# Altium schematic sheet Gate_Driver.SchDoc
size A4; SheetNumber: 2; SheetTotal: 3
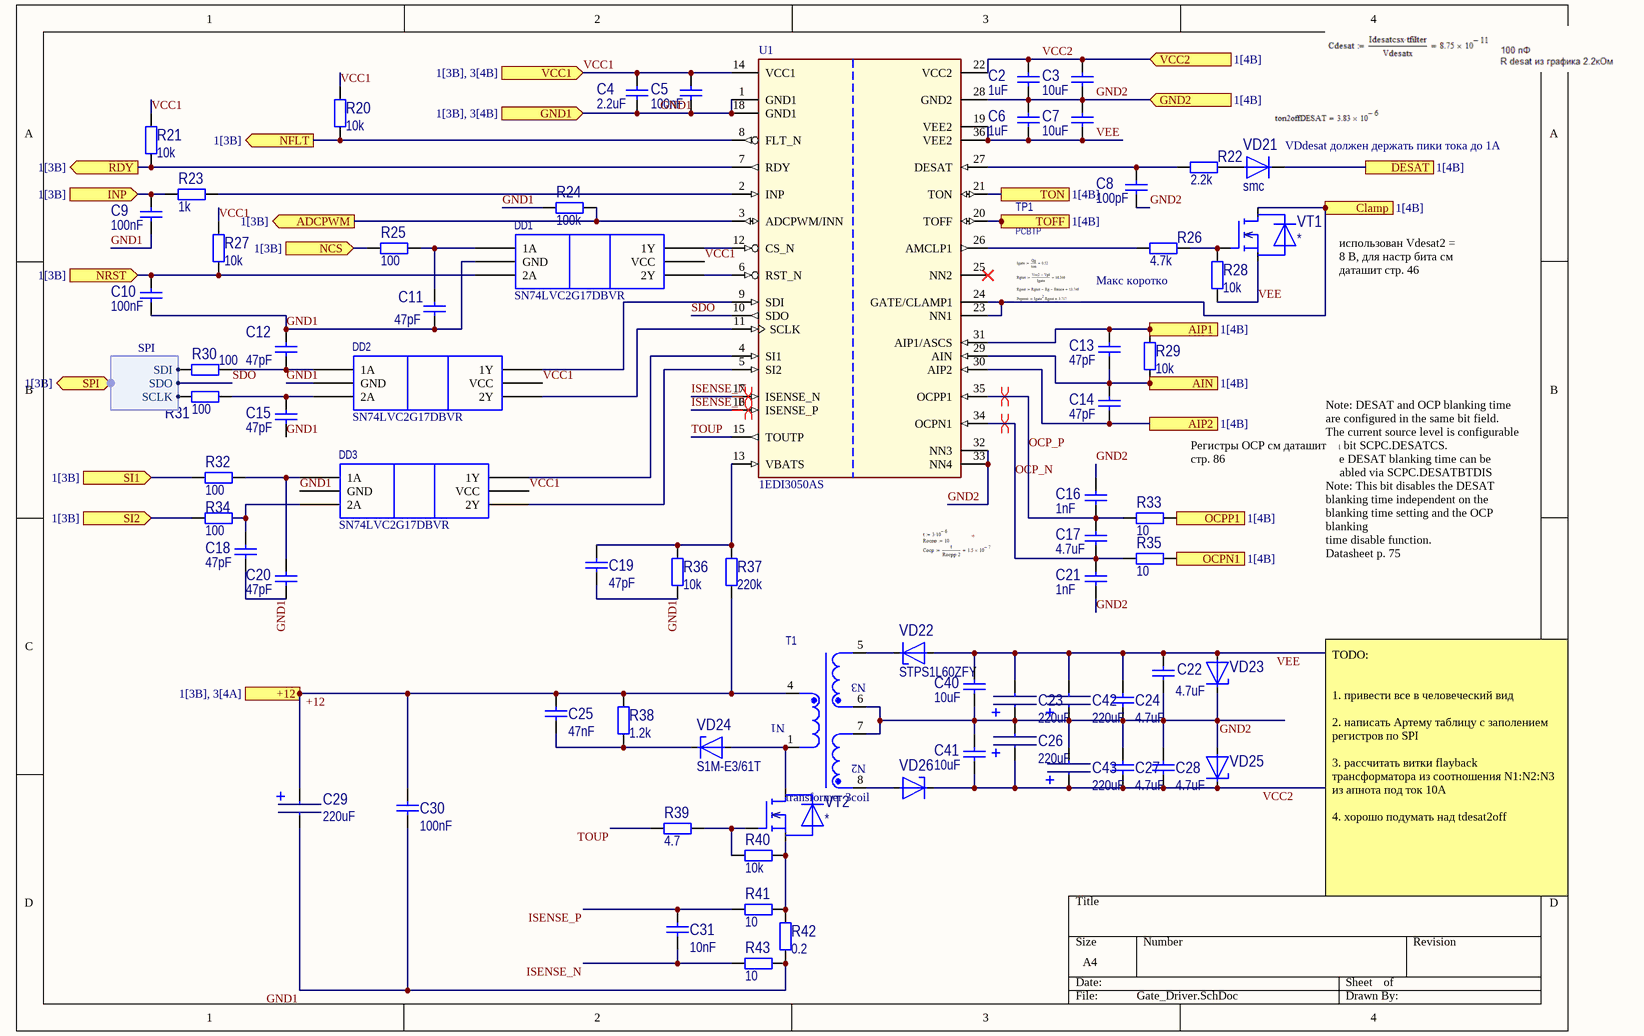
[diagram p0: Gate_Driver.SchDoc]

## Parts
C2  1uF  [6332[2512]]
C3  10uF  [6332[2512]]
C4  2.2uF  [3216[1206]]
C5  100nF  [2012[0805]]
C6  1uF  [6332[2512]]
C7  10uF  [6332[2512]]
C8  100pF  [2012[0805]]
C9  100nF  [2012[0805]]
C10  100nF  [2012[0805]]
C11  47pF  [2012[0805]]
C12  47pF  [2012[0805]]
C13  47pF  [2012[0805]]
C14  47pF  [2012[0805]]
C15  47pF  [2012[0805]]
C16  1nF  [2012[0805]]
C17  4.7uF  [2012[0805]]
C18  47pF  [2012[0805]]
C19  47pF  [2012[0805]]
C20  47pF  [2012[0805]]
C21  1nF  [2012[0805]]
C22  4.7uF  [6332[2512]]
C23  220uF  [ECAP 220 50V]
C24  4.7uF  [6332[2512]]
C25  47nF  [2012[0805]]
C26  220uF  [ECAP 220 50V]
C27  4.7uF  [6332[2512]]
C28  4.7uF  [6332[2512]]
C29  220uF  [A(3216)]
C30  100nF  [6332[2512]]
C31  10nF  [1005[0402]]
C40  10uF  [6332[2512]]
C41  10uF  [6332[2512]]
C42  220uF  [ECAP 220 50V]
C43  220uF  [ECAP 220 50V]
DD1  SN74LVC2G17DBVR  [SOT23-6]
DD2  SN74LVC2G17DBVR  [SOT23-6]
DD3  SN74LVC2G17DBVR  [SOT23-6]
R20  10k  [2012[0805]]
R21  10k  [2012[0805]]
R22  2.2k  [3216[1206]]
R23  1k  [2012[0805]]
R24  100k  [1005[0402]]
R25  100  [2012[0805]]
R26  4.7k  [2012[0805]]
R27  10k  [2012[0805]]
R28  10k  [2012[0805]]
R29  10k  [2012[0805]]
R30  100  [2012[0805]]
R31  100  [2012[0805]]
R32  100  [2012[0805]]
R33  10  [2012[0805]]
R34  100  [2012[0805]]
R35  10  [2012[0805]]
R36  10k  [2012[0805]]
R37  220k  [2012[0805]]
R38  1.2k  [2012[0805]]
R39  4.7  [2012[0805]]
R40  10k  [2012[0805]]
R41  10  [2012[0805]]
R42  0.2  [2512]
R43  10  [2012[0805]]
T1  transformer 3coil  [E 13/7/4]
TP1  PCBTP
U1  1EDI3050AS
VD21  smc  [SMС]
VD22  STPS1L60ZFY  [SOD-123]
VD23  (no value)  [SMС]
VD24  S1M-E3/61T  [SMB]
VD25  (no value)  [SMС]
VD26  (no value)  [SOD-123]
VT1  *
VT2  *

## Ports
+12 (in, see 1[3B], 3[4A]), ADCPWM (out, see 1[3B]), AIN (see 1[4B]), AIP1 (see 1[4B]), AIP2 (see 1[4B]), Clamp (see 1[4B]), DESAT (see 1[4B]), GND1 (in, see 1[3B], 3[4B]), GND2 (in, see 1[4B]), INP (in, see 1[3B]), NCS (in, see 1[3B]), NFLT (out, see 1[3B]), NRST (in, see 1[3B]), OCPN1 (see 1[4B]), OCPP1 (see 1[4B]), RDY (out, see 1[3B]), SI1 (in, see 1[3B]), SI2 (in, see 1[3B]), SPI (bidir, harness SPI, see 1[3B]), TOFF (see 1[4B]), TON (see 1[4B]), VCC1 (in, see 1[3B], 3[4B]), VCC2 (in, see 1[4B])

## Harnesses
SPI: SDI, SDO, SCLK

## Nets
+12: C25.1 C29.1 C30.1 R37.1 R38.2 T1.4 ; port +12
ADCPWM: R24.1 U1.3(ADCPWM/INN) ; port ADCPWM
AIN: C13.2 C14.1 R29.1 U1.29(AIN) ; port AIN
AIP1: C13.1 R29.2 U1.31(AIP1/ASCS) ; port AIP1
AIP2: C14.2 U1.30(AIP2) ; port AIP2
Clamp: U1.23(NN1) U1.24(GATE/CLAMP1) VT1.1(D) ; port Clamp
DESAT: VD21.2(K) ; port DESAT
GND1: C4.2 C5.2 C9.2 C10.2 C11.2 C12.1 C15.2 C18.2 C19.2 C20.2 C29.2 C30.2 DD1.2(GND) DD2.2(GND) DD3.2(GND) R24.2 R36.1 R42.2 R43.1 U1.1(GND1) U1.18(GND1) ; port GND1
GND2: C2.2 C3.2 C6.1 C7.1 C8.2 C16.1 C21.2 C22.1 C23.1 C24.1 C26.2 C27.2 C28.2 C40.2 C41.1 C42.1 C43.2 T1.6 T1.7 U1.28(GND2) U1.32(NN3) U1.33(NN4) VD23.2(K) VD25.1(A) ; port GND2
INP: C9.1 R23.2 ; port INP
ISENSE_N: C31.2 R43.2 U1.17(ISENSE_N)
ISENSE_P: C31.1 R41.2 U1.16(ISENSE_P)
NCS: R25.2 ; port NCS
NFLT: R20.1 U1.8(FLT_N) ; port NFLT
NRST: C10.1 DD1.3(2A) R27.1 ; port NRST
OCP_N: C17.2 C21.1 R35.2 U1.34(OCPN1)
OCP_P: C16.2 C17.1 R33.2 U1.35(OCPP1)
OCPN1: R35.1 ; port OCPN1
OCPP1: R33.1 ; port OCPP1
RDY: R21.1 U1.7(RDY) ; port RDY
SDO: U1.10(SDO) ; port SPI.SDO
SI1: R32.2 ; port SI1
SI2: R34.2 ; port SI2
TOFF: TP1.1 U1.20(TOFF) ; port TOFF
TON: U1.21(TON) ; port TON
TOUP: R39.1 U1.15(TOUTP)
VCC1: C4.1 C5.1 DD1.5(VCC) DD2.5(VCC) DD3.5(VCC) R20.2 R21.2 R27.2 U1.14(VCC1) ; port VCC1
VCC2: C2.1 C3.1 C26.1 C27.1 C28.1 C41.2 C43.1 U1.22(VCC2) VD25.2(K) VD26.2(K) ; port VCC2
VEE: C6.2 C7.2 C22.2 C23.2 C24.2 C40.1 C42.2 R28.1 U1.19(VEE2) U1.36(VEE2) VD22.1(A) VD23.1(A) VT1.3(S)
NetC8_1: C8.1 R22.1 U1.27(DESAT)
NetC11_1: C11.1 DD1.1(1A) R25.1
NetC12_2: C12.2 DD2.1(1A) R30.1
NetC15_1: C15.1 DD2.3(2A) R31.1
NetC18_1: C18.1 DD3.3(2A) R34.1
NetC19_1: C19.1 R36.2 R37.2 U1.13(VBATS)
NetC20_1: C20.1 DD3.1(1A) R32.1
NetC25_2: C25.2 R38.1 VD24.2(K)
NetDD1_4: DD1.4(2Y) U1.6(RST_N)
NetDD1_6: DD1.6(1Y) U1.12(CS_N)
NetDD2_4: DD2.4(2Y) U1.11(SCLK)
NetDD2_6: DD2.6(1Y) U1.9(SDI)
NetDD3_4: DD3.4(2Y) U1.5(SI2)
NetDD3_6: DD3.6(1Y) U1.4(SI1)
NetR22_2: R22.2 VD21.1(A)
NetR23_1: R23.1 U1.2(INP)
NetR26_1: R26.1 U1.26(AMCLP1)
NetR26_2: R26.2 R28.2 VT1.2(G)
NetR30_2: R30.2 ; port SPI.SDI
NetR31_2: R31.2 ; port SPI.SCLK
NetR39_2: R39.2 R40.2 VT2.2(G)
NetR40_1: R40.1 R41.1 R42.1 VT2.3(S)
NetT1_1: T1.1 VD24.1(A) VT2.1(D)
NetT1_5: T1.5 VD22.2(K)
NetT1_8: T1.8 VD26.1(A)

Not connected (* = marked no-connect by the designer): U1 25(NN2)*

## Layout directives
differential pair: ISENSE_N, ISENSE_P, OCP_N, OCP_P

## Notes on the sheet
- (near VD21) VDdesat должен держать пики тока до 1А
- (near R26) Макс коротко
- использован Vdesat2 = 8 В, для настр бита см даташит стр. 46
- (near R33) Регистры OCP см даташит стр. 86
- Note: DESAT and OCP blanking time are configured in the same bit field.
  The current source level is configurable via bit SCPC.DESATCS.
  The DESAT blanking time can be disabled via SCPC.DESATBTDIS
  Note: This bit disables the DESAT blanking time independent on the blanking time setting and the OCP blanking
  time disable function.
  Datasheet p. 75
- TODO:
  1. привести все в человеческий вид
  2. написать Артему таблицу с заполением регистров по SPI
  3. рассчитать витки flayback трансформатора из соотношения N1:N2:N3 из апнота под ток 10А
  4. хорошо подумать над tdesat2off
- (in symbol transformer 3coil) N3; N1; N2

## Library data of the parts
C2-C22 C24 C25 C27 C28 C30 C31 C40 C41 = C-4del: Конденсатор; Manufacturer: Murata; ManufacturerPartNumber: GRM21B X7R 104 50V; Power/Voltage: 50В; Value: 0.1; Tolerance: 10%; TKE/TKC: X7R; Specification: K; BCPId: *; Rem: *; Package: *; Type: Конденсатор; TU/GOST: *; Name: *; HelpURL: *; Price: *
C23 C26 C29 C42 C43 = C pol: Конденсатор электролитический; Specification: K; BCPId: *; Power/Voltage: *; Manufacturer: *; ManufacturerPartNumber: *; Rem: *; Package: *; Value: *; Type: Конденсатор; TU/GOST: *; Name: *; TKE/TKC: *; HelpURL: *; Price: *
DD1-DD3 = SN74LVC
R20-R43 = R-4del: Резистор; Manufacturer: Yageo; ManufacturerPartNumber: RC0805JR-07120R; Power/Voltage: 0.125Вт; Tolerance: 5%; Specification: K; BCPId: *; Rem: *; Package: *; Value: *; TU/GOST: *; Type: Резистор; Name: *; TKE/TKC: *; HelpURL: *; Price: *
TP1 = Testpoint
U1 = 1EDI3050AS: Single channel isolated IGBT/SiC-MOSFET driver; Manufacturer: Infineon Technologies; Manufacturer Order Number: 1EDI3050AS; PackageReference: PG-DSO-36-63
VD21 = VD Diod: Диод; Specification: K; BCPId: *; Manufacturer: *; Rem: *; Package: *; ManufacturerPartNumber: *; Type: Диод; TU/GOST: *; HelpURL: *; Price: *
VD22-VD26 = VD Stabilitron: Стабилитрон односторонний; Specification: K; BCPId: *; Manufacturer: *; Rem: *; Package: *; ManufacturerPartNumber: *; Type: Стабилитрон; TU/GOST: *; HelpURL: *; Price: *
VT1 VT2 = VT Transistor NMOS+D: Транзистор полевой n-канальный; Specification: K; BCPId: *; Manufacturer: *; Rem: *; Package: *; ManufacturerPartNumber: *; Type: Транзистор; TU/GOST: *; HelpURL: *; Price: *